# EAGLE design NSA_Control_FinalPTH3_compact (EAGLE 6.4)
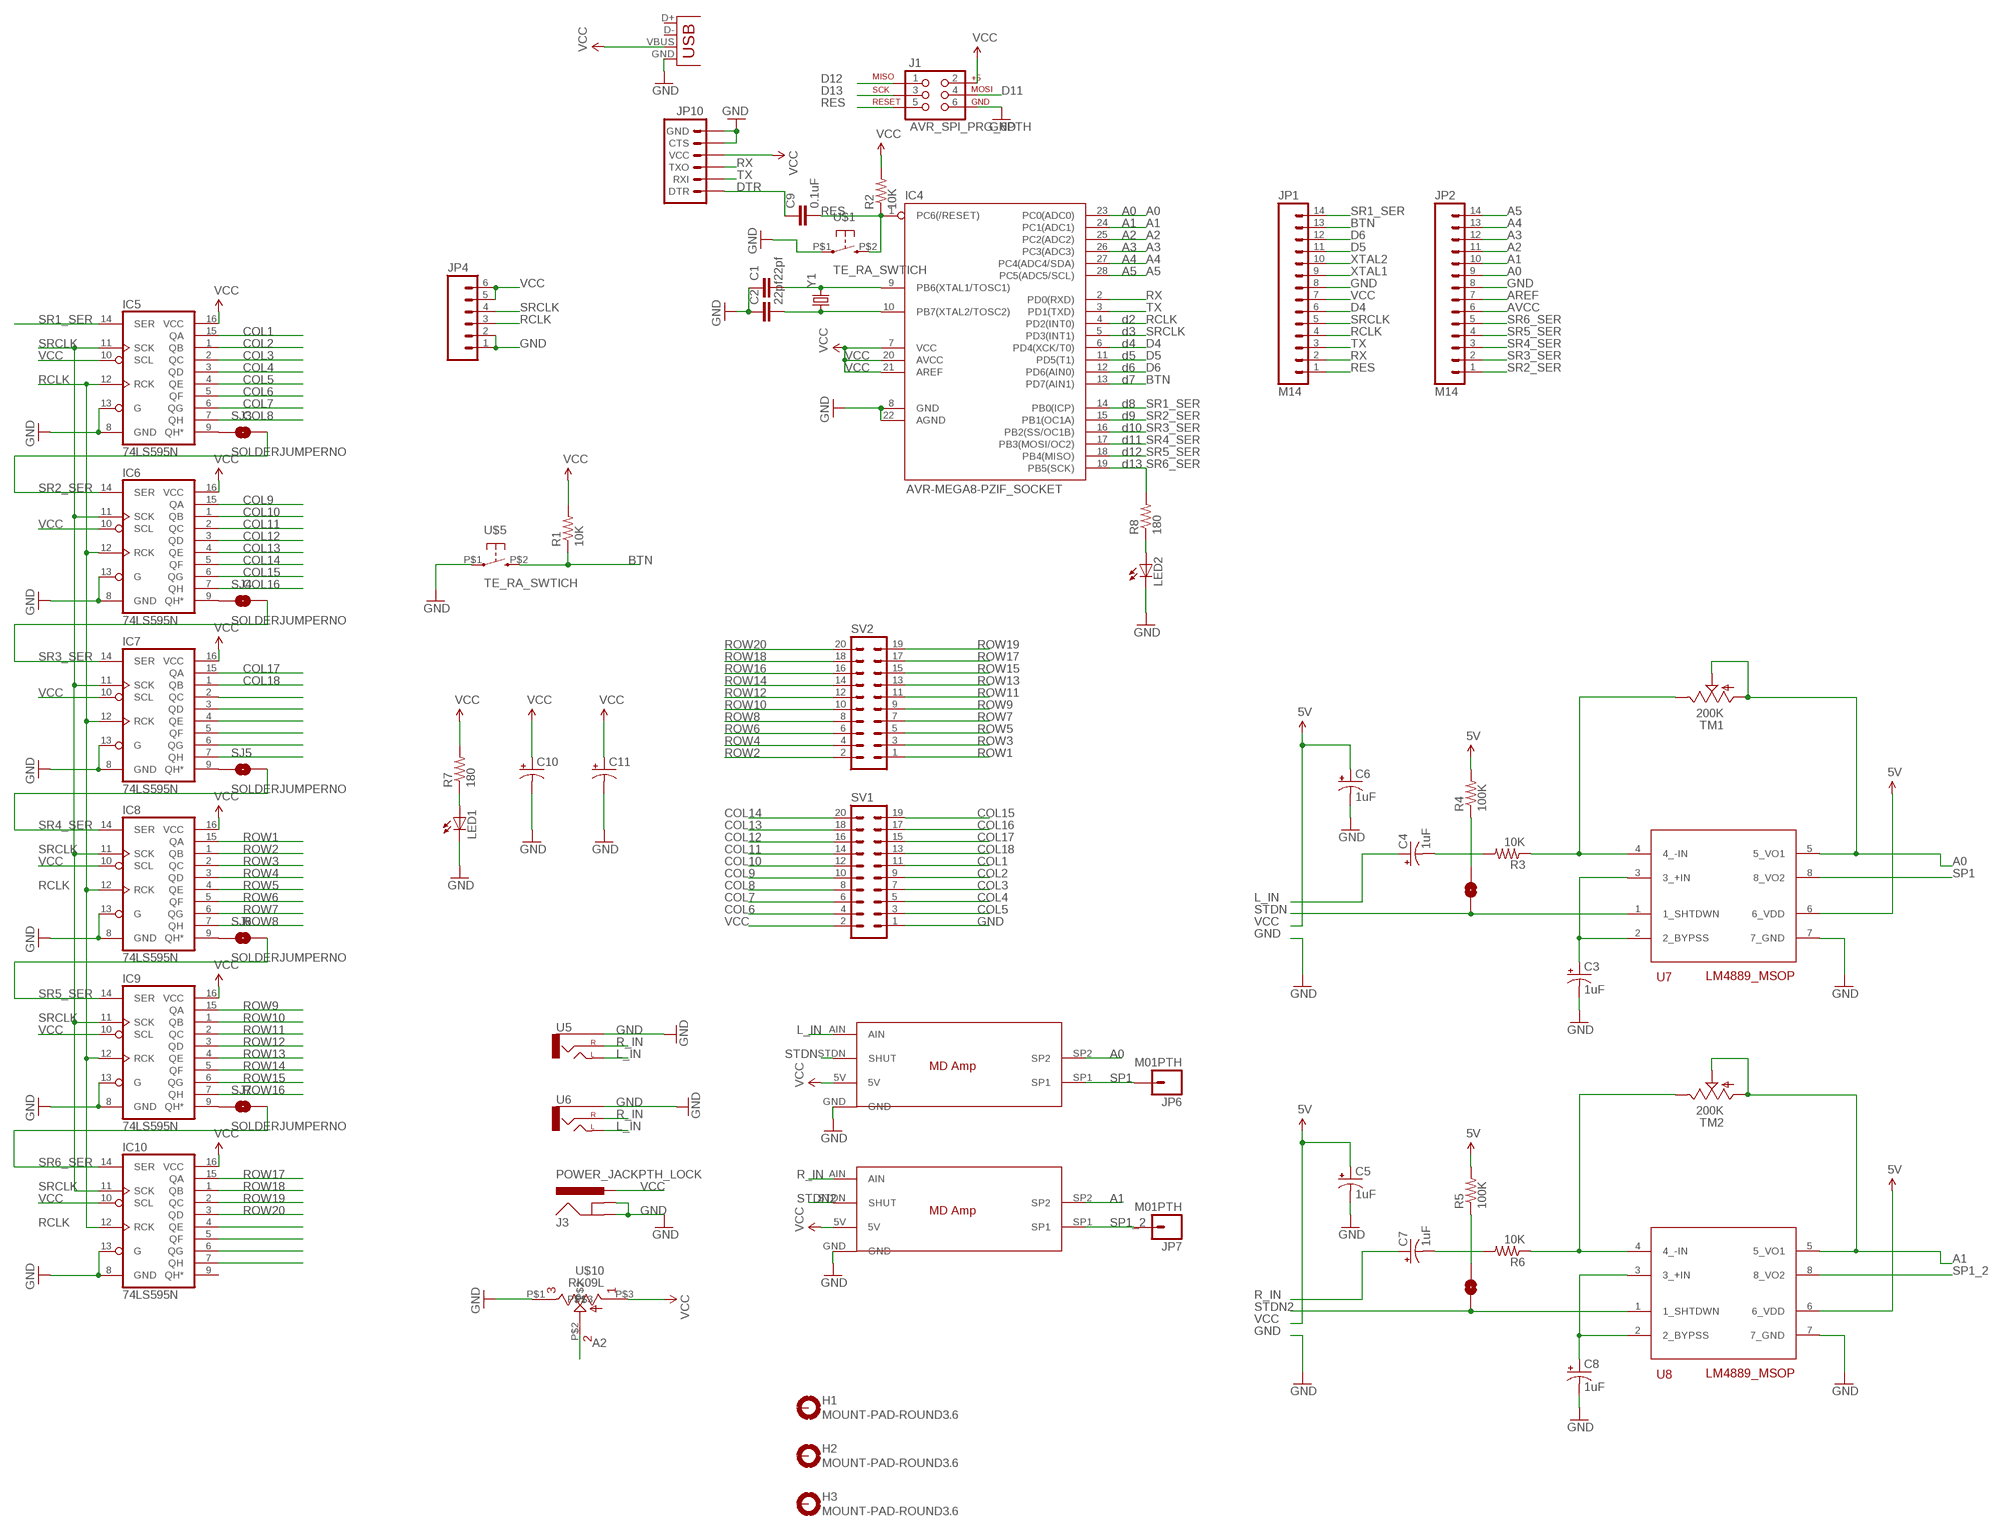
[diagram p0: schematic, sheet 1]

## Parts
C1  22pf  CAPPTH  [CAP-PTH-SMALL]
C2  22pf  CAPPTH  [CAP-PTH-SMALL]
C3  1uF  CAP_POL1206-KIT  [EIA3216-KIT]
C4  1uF  CAP_POL1206-KIT  [EIA3216-KIT]
C5  1uF  CAP_POL1206-KIT  [EIA3216-KIT]
C6  1uF  CAP_POL1206-KIT  [EIA3216-KIT]
C7  1uF  CAP_POL1206-KIT  [EIA3216-KIT]
C8  1uF  CAP_POL1206-KIT  [EIA3216-KIT]
C9  0.1uF  CAPPTH  [CAP-PTH-SMALL]
C10  CPOL-USE5-8.5  [E5-8,5]
C11  CPOL-USE5-8.5  [E5-8,5]
H1  MOUNT-PAD-ROUND3.6  [3,6-PAD]
H2  MOUNT-PAD-ROUND3.6  [3,6-PAD]
H3  MOUNT-PAD-ROUND3.6  [3,6-PAD]
IC4  AVR-MEGA8-PZIF_SOCKET  [DIL28-3-ZIF_SOCKET]
IC5  74LS595N  [DIL16]
IC6  74LS595N  [DIL16]
IC7  74LS595N  [DIL16]
IC8  74LS595N  [DIL16]
IC9  74LS595N  [DIL16]
IC10  74LS595N  [DIL16]
J1  AVR_SPI_PRG_6PTH  [2X3]
J3  POWER_JACKPTH_LOCK  [POWER_JACK_PTH_LOCK]
JP1  M14  [1X14]
JP2  M14  [1X14]
JP4  M06LONGPADS  [1X06_LONGPADS]
JP6  M01PTH  [1X01]
JP7  M01PTH  [1X01]
JP10  ARDUINO_SERIAL_PROGRAMLOCK  [1X06_LOCK]
LED1  LED5MM  [LED5MM]
LED2  LED5MM  [LED5MM]
R1  10K  RESISTORPTH-1/4W  [AXIAL-0.4]
R2  10K  RESISTORPTH-1/4W  [AXIAL-0.4]
R3  10K  RESISTOR1206  [1206]
R4  100K  RESISTOR1206  [1206]
R5  100K  RESISTOR1206  [1206]
R6  10K  RESISTOR1206  [1206]
R7  180  RESISTORPTH-1/4W  [AXIAL-0.4]
R8  180  RESISTORPTH-1/4W  [AXIAL-0.4]
SJ1  SOLDERJUMPERNC  [SJ_2S]
SJ2  SOLDERJUMPERNC  [SJ_2S]
SJ3  SOLDERJUMPERNO  [SJ_2S-NO]
SJ4  SOLDERJUMPERNO  [SJ_2S-NO]
SJ5  SOLDERJUMPERNO  [SJ_2S-NO]
SJ6  SOLDERJUMPERNO  [SJ_2S-NO]
SJ7  SOLDERJUMPERNO  [SJ_2S-NO]
SV1  ML20  [ML20]
SV2  ML20  [ML20]
TM1  200K  TRIM  [6MM]
TM2  200K  TRIM  [6MM]
U5  AUDIO-JACKPTH  [AUDIO-JACK]
U6  AUDIO-JACKPTH  [AUDIO-JACK]
U7  LM4889_MSOP  [MSOP8]
U8  LM4889_MSOP  [MSOP8]
U$1  TE_RA_SWTICH  [TE_RA_SWITCH]
U$5  TE_RA_SWTICH  [TE_RA_SWITCH]
U$6  MD_AMP  [MD_AMP]
U$7  MD_AMP  [MD_AMP]
U$10  RK09L  [RK09L]
X1  USBSMD  [USB-MINIB]
Y1  CRYSTALHC49UV  [HC49U-V]

## Nets
6V: R4.2 R5.2 U7.6(6_VDD) U8.6(6_VDD) ; supply symbol labelled 5V
A0: IC4.23(PC0(ADC0)) JP2.9 TM1.A TM1.S U7.5(5_VO1) U$6.SP2
A1: IC4.24(PC1(ADC1)) JP2.10 TM2.A TM2.S U8.5(5_VO1) U$7.SP2
A2: IC4.25(PC2(ADC2)) JP2.11 U$10.P$2
A3: IC4.26(PC3(ADC3)) JP2.12
A4: IC4.27(PC4(ADC4/SDA)) JP2.13
A5: IC4.28(PC5(ADC5/SCL)) JP2.14
AREF: JP2.7
AVCC: JP2.6
BTN: IC4.13(PD7(AIN1)) JP1.13 R1.P$1 U$5.P$2
COL1: IC5.15(QA) SV1.11
COL2: IC5.1(QB) SV1.9
COL3: IC5.2(QC) SV1.7
COL4: IC5.3(QD) SV1.5
COL5: IC5.4(QE) SV1.3
COL6: IC5.5(QF) SV1.4
COL7: IC5.6(QG) SV1.6
COL8: IC5.7(QH) SV1.8
COL9: IC6.15(QA) SV1.10
COL10: IC6.1(QB) SV1.12
COL11: IC6.2(QC) SV1.14
COL12: IC6.3(QD) SV1.16
COL13: IC6.4(QE) SV1.18
COL14: IC6.5(QF) SV1.20
COL15: IC6.6(QG) SV1.19
COL16: IC6.7(QH) SV1.17
COL17: IC7.15(QA) SV1.15
COL18: IC7.1(QB) SV1.13
D4: IC4.6(PD4(XCK/T0)) JP1.6
D5: IC4.11(PD5(T1)) JP1.11
D6: IC4.12(PD6(AIN0)) JP1.12
D11: J1.4
D12: J1.1
D13: J1.3
DTR: C9.1 JP10.1(DTR)
GND: C1.1 C2.1 C3.C(-) C5.C(-) C6.C(-) C8.C(-) C10.- C11.- IC4.8(GND) IC4.22(AGND) IC5.8(GND) IC5.13(G) IC6.8(GND) IC6.13(G) IC7.8(GND) IC7.13(G) IC8.8(GND) IC8.13(G) IC9.8(GND) IC9.13(G) IC10.8(GND) IC10.13(G) J1.6 J3.GND J3.GNDBREAK JP1.8 JP2.8 JP4.1 JP4.2 JP10.5(CTS) JP10.6(GND) LED1.K(C) LED2.K(C) SV1.1 U5.SLEEVE U6.SLEEVE U7.7(7_GND) U8.7(7_GND) U$1.P$1 U$5.P$1 U$6.GND U$7.GND U$10.P$1 X1.GND
L_IN: C4.A(+) U5.TIP(LEFT) U6.TIP(LEFT) U$6.AIN
N$1: IC7.4(QE)
N$2: IC7.5(QF)
N$3: IC7.6(QG)
N$4: IC7.7(QH)
N$5: IC10.4(QE)
N$6: IC10.5(QF)
N$7: LED1.A R7.P$1
N$8: LED2.A R8.P$1
N$9: IC10.6(QG)
N$10: C8.A(+) U8.2(2_BYPSS) U8.3(3_+IN)
N$11: IC5.9(QH*) SJ3.1
N$12: IC6.9(QH*) SJ4.1
N$13: IC10.7(QH)
N$14: C3.A(+) U7.2(2_BYPSS) U7.3(3_+IN)
N$15: R6.1 TM2.E U8.4(4_-IN)
N$16: R3.1 TM1.E U7.4(4_-IN)
N$17: C4.C(-) R3.2
N$18: C7.C(-) R6.2
N$19: R4.1 SJ1.2
N$20: R5.1 SJ2.2
N$21: IC7.2(QC)
N$22: IC7.3(QD)
N$23: IC7.9(QH*) SJ5.1
N$24: IC8.9(QH*) SJ6.1
N$25: IC9.9(QH*) SJ7.1
R_IN: C7.A(+) U5.RING(RIGHT) U6.RING(RIGHT) U$7.AIN
RCLK: IC4.4(PD2(INT0)) IC5.12(RCK) IC6.12(RCK) IC7.12(RCK) IC8.12(RCK) IC9.12(RCK) IC10.12(RCK) JP1.4 JP4.3
RES: C9.2 IC4.1(PC6(/RESET)) J1.5 JP1.1 R2.P$1 U$1.P$2
ROW1: IC8.15(QA) SV2.1
ROW2: IC8.1(QB) SV2.2
ROW3: IC8.2(QC) SV2.3
ROW4: IC8.3(QD) SV2.4
ROW5: IC8.4(QE) SV2.5
ROW6: IC8.5(QF) SV2.6
ROW7: IC8.6(QG) SV2.7
ROW8: IC8.7(QH) SV2.8
ROW9: IC9.15(QA) SV2.9
ROW10: IC9.1(QB) SV2.10
ROW11: IC9.2(QC) SV2.11
ROW12: IC9.3(QD) SV2.12
ROW13: IC9.4(QE) SV2.13
ROW14: IC9.5(QF) SV2.14
ROW15: IC9.6(QG) SV2.15
ROW16: IC9.7(QH) SV2.16
ROW17: IC10.15(QA) SV2.17
ROW18: IC10.1(QB) SV2.18
ROW19: IC10.2(QC) SV2.19
ROW20: IC10.3(QD) SV2.20
RX: IC4.2(PD0(RXD)) JP1.2 JP10.3(TXO)
SP1: JP6.1 U7.8(8_VO2) U$6.SP1
SP1_2: JP7.1 U8.8(8_VO2) U$7.SP1
SR1_SER: IC4.14(PB0(ICP)) IC5.14(SER) JP1.14
SR2_SER: IC4.15(PB1(OC1A)) IC6.14(SER) JP2.1 SJ3.2
SR3_SER: IC4.16(PB2(SS/OC1B)) IC7.14(SER) JP2.2 SJ4.2
SR4_SER: IC4.17(PB3(MOSI/OC2)) IC8.14(SER) JP2.3 SJ5.2
SR5_SER: IC4.18(PB4(MISO)) IC9.14(SER) JP2.4 SJ6.2
SR6_SER: IC4.19(PB5(SCK)) IC10.14(SER) JP2.5 R8.P$2 SJ7.2
SRCLK: IC4.5(PD3(INT1)) IC5.11(SCK) IC6.11(SCK) IC7.11(SCK) IC8.11(SCK) IC9.11(SCK) IC10.11(SCK) JP1.5 JP4.4
STDN: SJ1.1 U7.1(1_SHTDWN) U$6.STDN(SHUT)
STDN2: SJ2.1 U8.1(1_SHTDWN) U$7.STDN(SHUT)
TX: IC4.3(PD1(TXD)) JP1.3 JP10.2(RXI)
VCC: C5.A(+) C6.A(+) C10.+ C11.+ IC4.7(VCC) IC4.20(AVCC) IC4.21(AREF) IC5.10(SCL) IC5.16(VCC) IC6.10(SCL) IC6.16(VCC) IC7.10(SCL) IC7.16(VCC) IC8.10(SCL) IC8.16(VCC) IC9.10(SCL) IC9.16(VCC) IC10.10(SCL) IC10.16(VCC) J1.2 J3.PWR JP1.7 JP4.5 JP4.6 JP10.4(VCC) R1.P$2 R2.P$2 R7.P$2 SV1.2 U$6.5V U$7.5V U$10.P$3 X1.VBUS ; supply symbol labelled 5V
XTAL1: C1.2 IC4.9(PB6(XTAL1/TOSC1)) JP1.9 Y1.2
XTAL2: C2.2 IC4.10(PB7(XTAL2/TOSC2)) JP1.10 Y1.1
Unconnected: H1.B3,6(MOUNT) H2.B3,6(MOUNT) H3.B3,6(MOUNT) IC10.9(QH*) X1.D+ X1.D-

## Notes on the sheet
- A0
- A1
- A2
- A3
- A4
- A5
- d2
- d3
- d4
- d5
- d6
- d7
- d8
- d9
- d10
- d11
- d12
- d13

## Library data of the parts
C1 C2 C9 = sparkFun:CAP: Capacitor Standard 0603 ceramic capacitor, and 0.1" leaded capacitor.
C3-C8 = sparkFun:CAP_POL: Capacitor Polarized These are standard SMD and PTH capacitors. Normally 10uF, 47uF, and 100uF in electrolytic and tantalum varieties. Always verify the external diameter of the through hole cap, it varies with capacity, voltage, and manufacturer. The EIA devices should be standard.
C10 C11 = adafruit:CPOL-US: POLARIZED CAPACITOR, American symbol
H1-H3 = holes:MOUNT-PAD-ROUND: MOUNTING PAD, round
IC4 = sparkFun:AVR-MEGA8-P: MICROCONTROLLER 8 Kbytes FLASH 1 kbytes SRAM 512 bytes EEPROM USART 4-channel 10 bit ADC 2-channel 8 bit ADC
IC5-IC10 = sparkFun:74*595: 8-bit SHIFT REGISTER, output latch
J1 = sparkFun:AVR_SPI_PRG_6: AVR ISP 6 Pin This is the reduced ISP connector for AVR programming. Common on Arduino. This footprint will take up less PCB space and can be used with a 10-pin to 6-pin adapter such as SKU: BOB-08508
J3 = sparkFun:POWER_JACK: Power Jack This is the standard 5.5mm barrel jack for power. The PTH is the most common, proven, reliable, footprint. All others are experimental. The Slot footprint only works if the mill layer is transmitted to the PCB fab house so be warned. Spark Fun Electronics SKU : PRT-00119. Mating wall wart : TOL-00298 (and others)
JP1 JP2 = sparkFun:M14: Header 14 Standard 14-pin 0.1" header. Use with straight break away headers (SKU : PRT-00116), right angle break away headers (PRT-00553), swiss pins (PRT-00743), machine pins (PRT-00117), and female headers (PRT-00115).
JP4 = sparkFun:M06: Header 6 Standard 6-pin 0.1" header. Use with straight break away headers (SKU : PRT-00116), right angle break away headers (PRT-00553), swiss pins (PRT-00743), machine pins (PRT-00117), and female headers (PRT-00115). Molex polarized connector foot print use with SKU : PRT-08094 with associated crimp pins and housings. NOTES ON THE VARIANTS LOCK and LOCK_LONGPADS... This footprint was designed to help hold the alignment of a through-hole component (i.e. 6-pin header) while soldering it into place. You may notice that each hole has been shifted either up or down by 0.005 of an inch from it's more standard position (which is a perfectly straight line). This slight alteration caused the pins (the squares in the middle) to touch the edges of the holes. Because they are alternating, it causes a "brace" to hold the component in place. 0.005 has proven to be the perfect amount of "off-center" position when using our standard breakaway headers. Although looks a little odd when you look at the bare footprint, once you have a header in there, the alteration is very hard to notice. Also, if you push a header all the way into place, it is covered up entirely on the bottom side. This idea of altering the position of holes to aid alignment will be further integrated into the Sparkfun Library for other footprints. It can help hold any component with 3 or more connection pins.
JP6 JP7 = sparkFun:M01: Header 1 Standard 1-pin 0.1" header. Use with straight break away headers (SKU : PRT-00116), right angle break away headers (PRT-00553), swiss pins (PRT-00743), machine pins (PRT-00117), and female headers (PRT-00115).
JP10 = sparkFun:ARDUINO_SERIAL_PROGRAM
LED1 LED2 = sparkFun:LED: LEDs Standard schematic elements and footprints for 5mm, 3mm, 1206, and 0603 sized LEDs. 5mm - Spark Fun Electronics SKU : COM-00529 (and others)
R1-R8 = sparkFun:RESISTOR: Resistor Basic schematic elements and footprints for 0603, 1206, and PTH resistors.
SJ1 SJ2 = ModernDevice:SOLDERJUMPER: Solder Jumper Standard SMD solder jumper. Used to automate production. Two varients : Normally Open and Normally Closed are the same, but have different paste layers. NC will have a large amount of paste and should jumper during reflow.
SJ3-SJ7 = sparkFun:SOLDERJUMPER: Solder Jumper Standard SMD solder jumper. Used to automate production. Two varients : Normally Open and Normally Closed are the same, but have different paste layers. NC will have a large amount of paste and should jumper during reflow.
SV1 SV2 = con-harting-ml:ML20: HARTING; OC_FARNELL: unknown; OC_NEWARK: unknown
TM1 TM2 = adafruit:TRIM
U5 U6 = sparkFun:AUDIO-JACK: 3.5mm Audio Jack Simple 3.5mm common PCB mount audio jack. SKU: PRT-08032
U7 U8 = ModernDevice:LM4889: LM4889 1 W Audio Amp
U$1 U$5 = 001_BoltCustom:TE_RA_SWTICH
U$6 U$7 = 001_BoltCustom:MD_AMP
U$10 = 001_BoltCustom:RK09L
X1 = sparkFun:USB: USB Connectors USB-B-PTH is fully proven SKU : PRT-00139 USB-miniB is fully proven SKU : PRT-00587 USB-A-PCB is untested. USB-A-H is throughly reviewed, but untested. Spark Fun Electronics SKU : PRT-00437 USB-B-SMT is throughly reviewed, but untested. Needs silkscreen touching up. USB-A-S has not been used/tested USB-MB-H has not been used/tested
Y1 = sparkFun:CRYSTAL: Crystals Various standard crystals. Proven footprints. Spark Fun Electronics SKU : COM-00534

## Board
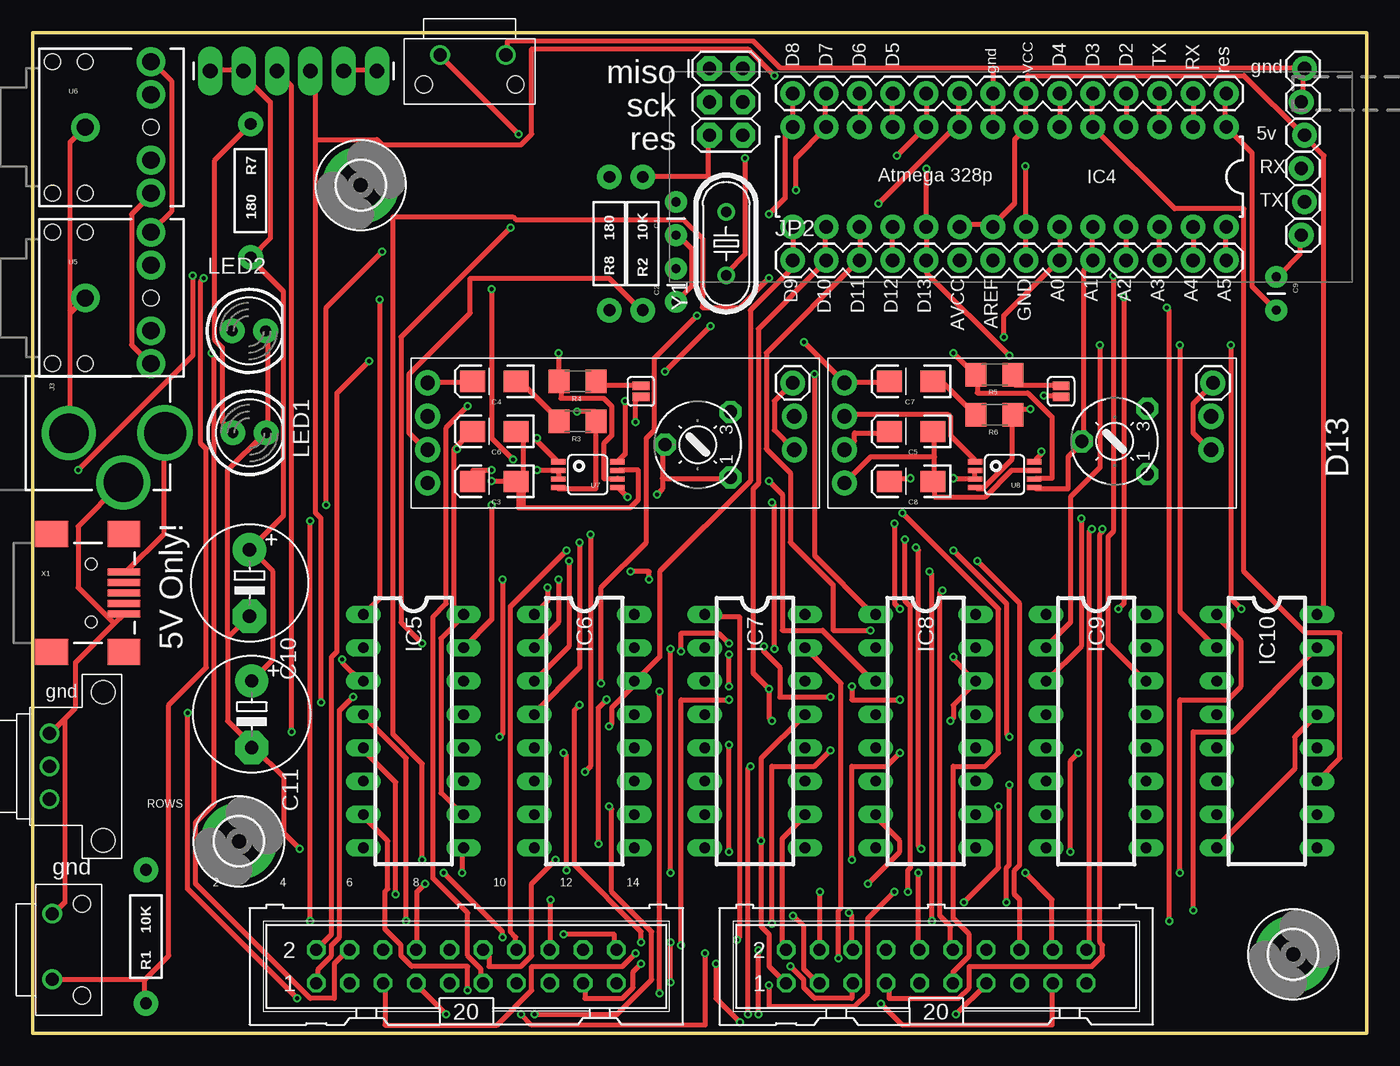
[diagram p1: board, top side]
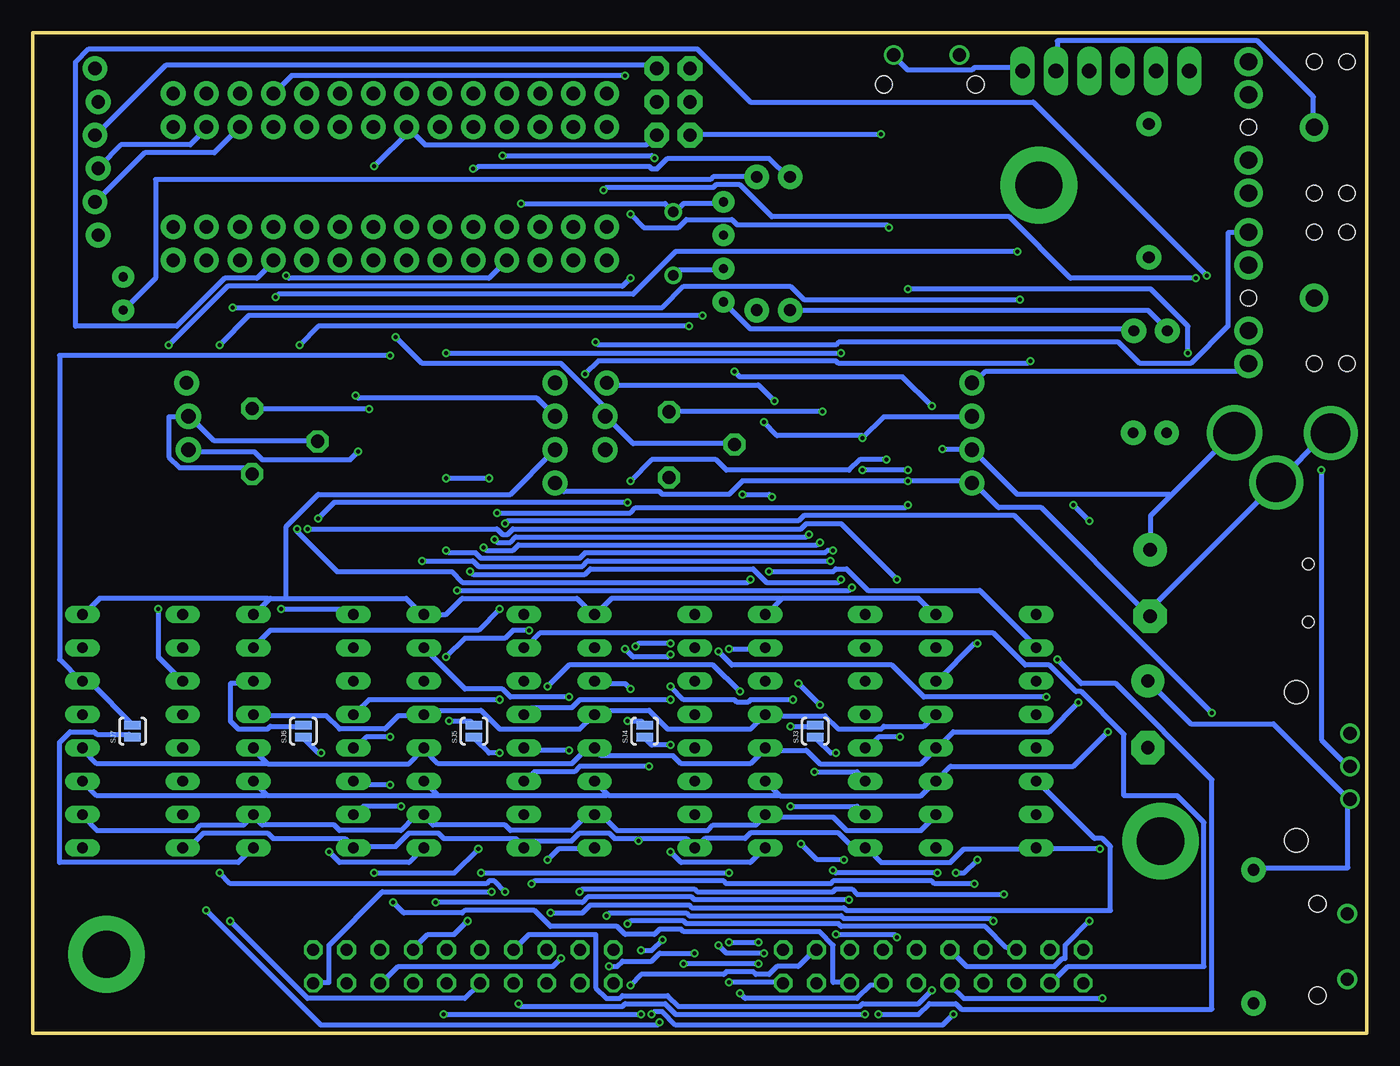
[diagram p2: board, bottom side, seen from below]

Size 101.6 x 76.2 mm. Coordinates in mm from the lower left corner, seen from the top.
Outline: 0,0 101.6,0 101.6,76.2 0,76.2 0,0
Copper layers (1*16): Top 0.035mm / dielectric 1.5mm / Bottom 0.035mm
Design rules "default *": minimum track width 15mil, minimum drill 12mil, track to track 7mil, track to pad 7mil, pad to pad 7mil, via to via 7mil, smd to smd 0mil, copper to edge 10mil, drill to drill 10mil, minimum pad ring 10mil, minimum via ring 6mil, stop-mask expansion 2mil, vias tented up to drill 100mil, thermal gap 10mil

### Footprints (pad centres in the part's own frame; a part is rotated, then mirrored left to right if it is on the bottom)
CAP-PTH-SMALL = drill 0.7 pad 1.651: 1 0,0; 2 2.54,0
EIA3216-KIT = smd 1.9 x 1.6: A 1.65,0; C -1.65,0
E5-8,5 = drill 1.016 pad 2.54: + -2.54,0 | drill 1.016 pad 2.54 octagon: - 2.54,0
3,6-PAD = drill 3.6 pad 5.842: B3,6 0,0
DIL28-3-ZIF_SOCKET = drill 1.016 pad 1.88: 1 -16.51,-3.81; 2 -13.97,-3.81; 3 -11.43,-3.81; 4 -8.89,-3.81; 5 -6.35,-3.81; 6 -3.81,-3.81; 7 -1.27,-3.81; 8 1.27,-3.81; 9 3.81,-3.81; 10 6.35,-3.81; 11 8.89,-3.81; 12 11.43,-3.81; 13 13.97,-3.81; 14 16.51,-3.81; 15 16.51,3.81; 16 13.97,3.81; 17 11.43,3.81; 18 8.89,3.81; 19 6.35,3.81; 20 3.81,3.81; 21 1.27,3.81; 22 -1.27,3.81; 23 -3.81,3.81; 24 -6.35,3.81; 25 -8.89,3.81; 26 -11.43,3.81; 27 -13.97,3.81; 28 -16.51,3.81
DIL16 = drill 0.813 long: 1 -8.89,-3.81; 2 -6.35,-3.81; 3 -3.81,-3.81; 4 -1.27,-3.81; 5 1.27,-3.81; 6 3.81,-3.81; 7 6.35,-3.81; 8 8.89,-3.81; 9 8.89,3.81; 10 6.35,3.81; 11 3.81,3.81; 12 1.27,3.81; 13 -1.27,3.81; 14 -3.81,3.81; 15 -6.35,3.81; 16 -8.89,3.81
2X3 = drill 1.016 pad 1.88 octagon: 1 0,0; 2 0,2.54; 3 2.54,0; 4 2.54,2.54; 5 5.08,0; 6 5.08,2.54
POWER_JACK_PTH_LOCK = drill 2.997 pad 4.115: GND 0.025,6.557; GNDBREAK 3.762,10.7 | drill 3.2 pad 4.115: PWR 0,13.878
1X14 = drill 1.016 pad 1.88: 1 0,0; 2 2.54,0; 3 5.08,0; 4 7.62,0; 5 10.16,0; 6 12.7,0; 7 15.24,0; 8 17.78,0; 9 20.32,0; 10 22.86,0; 11 25.4,0; 12 27.94,0; 13 30.48,0; 14 33.02,0
1X06_LONGPADS = drill 1.118 pad 1.88 long: 1 0,0; 2 2.54,0; 3 5.08,0; 4 7.62,0; 5 10.16,0; 6 12.7,0
1X01 = drill 1.016 pad 1.88: 1 0,0
1X06_LOCK = drill 1.016 pad 1.88: 1 0,0; 2 2.54,-0.254; 3 5.08,0; 4 7.62,-0.254; 5 10.16,0; 6 12.7,-0.254
LED5MM = drill 0.813 pad 1.88: A -1.27,0; K 1.27,0
AXIAL-0.4 = drill 0.9 pad 1.88: P$1 -5.08,0; P$2 5.08,0
1206 = smd 1.6 x 1.8: 1 -1.4,0; 2 1.4,0
SJ_2S = smd 0.635 x 1.27: 1 -0.412,0; 2 0.412,0
SJ_2S-NO = smd 0.635 x 1.27: 1 -0.45,0; 2 0.45,0
ML20 = drill 0.914 octagon: 1 -11.43,-1.27; 2 -11.43,1.27; 3 -8.89,-1.27; 4 -8.89,1.27; 5 -6.35,-1.27; 6 -6.35,1.27; 7 -3.81,-1.27; 8 -3.81,1.27; 9 -1.27,-1.27; 10 -1.27,1.27; 11 1.27,-1.27; 12 1.27,1.27; 13 3.81,-1.27; 14 3.81,1.27; 15 6.35,-1.27; 16 6.35,1.27; 17 8.89,-1.27; 18 8.89,1.27; 19 11.43,-1.27; 20 11.43,1.27
6MM = drill 1 pad 1.676 octagon: A -2.5,-2.5; E 2.5,-2.5; S 0,2.5
AUDIO-JACK = drill 1.3 pad 2.184: RING 5,5; RSH 5,2.5; SLEEVE 0,0; TIP 5,-5; TSH 5,-2.5 | hole 1.2: 0,5; -2.5,5; -2.5,-5; 0,-5; 5,0
MSOP8 = smd 0.4 x 1.1: 1 -0.975,-2.25; 2 -0.325,-2.25; 3 0.325,-2.25; 4 0.975,-2.25; 5 0.975,2.25; 6 0.325,2.25; 7 -0.325,2.25; 8 -0.975,2.25
TE_RA_SWITCH = drill 1: P$1 -2.75,2.75; P$2 2.25,2.75 | hole 1.3: -3.5,5; 3.5,5
MD_AMP = drill 1.1 pad 1.93: 5V 1.27,4.445; AIN 1.27,9.525; GND 1.27,1.905; SP1 29.21,4.445; SP2 29.21,6.985; STDN 1.27,6.985
RK09L = drill 1: P$1 -2.5,0; P$2 0,0; P$3 2.5,0 | hole 1.8: -5.65,4.1; 5.65,4.1
USB-MINIB = smd 2.5 x 0.5: D+ 2.5,0; D- 2.5,0.8; GND 2.5,-1.6; ID 2.5,-0.8; VBUS 2.5,1.6 | smd 2.5 x 2: MTN1 -3,4.5; MTN2 2.5,4.5; MTN3 -3,-4.5; MTN4 2.5,-4.5 | hole 0.9: 0,2.2; 0,-2.2
HC49U-V = drill 0.813: 1 -2.413,0; 2 2.413,0

### Placement (x,y rotation side)
C1  49,60.78 90 top
C2  49,55.7 90 top
C3  35.15,42.03 180 top
C4  35.15,49.65 180 top
C5  66.9,45.84 180 top
C6  35.15,45.84 180 top
C7  66.9,49.65 180 top
C8  66.9,42.03 180 top
C9  94.72,57.61 270 top
C10  16.51,34.29 270 top
C11  16.67,24.29 270 top
H1  15.7,14.62 0 top
H2  96,6 0 top
H3  24.98,64.59 0 top
IC4  74.4,65.23 180 top
IC5  29,23 270 top
IC6  42,23 270 top
IC7  55,23 270 top
IC8  68,23 270 top
IC9  81,23 270 top
IC10  94,23 270 top
J1  51.54,73.48 270 top
J3  -3.81,45.72 270 top
JP1  90.91,71.58 180 top
JP2  57.89,58.88 0 top
JP4  26.21,73.3 180 top
JP6  57.88,49.52 270 top
JP7  89.89,49.52 270 top
JP10  96.62,60.78 90 top
LED1  16.51,45.72 0 top
LED2  16.46,53.49 0 top
R1  8.62,7.35 90 top
R2  46.46,60.15 270 top
R3  41.5,46.6 180 top
R4  41.5,49.65 180 top
R5  73.25,50.16 180 top
R6  73.25,47.11 180 top
R7  16.59,64.18 270 top
R8  43.92,60.15 90 top
SJ1  46.33,48.89 90 top
SJ2  78.33,48.89 90 top
SJ3  42,23 90 bottom
SJ4  55,23 90 bottom
SJ5  68,23 90 bottom
SJ6  81,23 90 bottom
SJ7  94,23 90 bottom
SV1  68.81,5.08 0 top
SV2  33.02,5.08 0 top
TM1  50.64,44.83 90 top
TM2  82.39,45.08 90 top
U5  4,56 0 top
U6  4,69 0 top
U7  42.26,42.54 270 top
U8  74.01,42.54 270 top
U$1  33.27,77.27 180 top
U$5  -1.27,6.35 270 top
U$6  28.8,40 0 top
U$7  60.55,40 0 top
U$10  1.27,20.32 270 top
X1  4.45,33.53 0 top
Y1  52.81,60.15 90 top

### Tracks (layer width: path | path; a pad name or v marks a point on that pad's centre or on a via)
6V  (via drill 0.3)
  Top 0.381: U7.6 44.5,42.27 43.48,42.27 43.48,44.91 44.09,45.52 44.09,47.75 43.48,48.36 40.23,48.36 40.23,49.58 R4.2 40.03,49.78 v40.03,51.82 | U8.6 76.4,42.27 77.62,42.27 77.62,46.94 75.79,48.77 71.93,48.77 71.93,49.99 R5.2 71.73,50.19 v70.1,51.82
  Bottom 0.381: v70.1,51.82 v40.03,51.82
A0  (via drill 0.3)
  Top 0.381: IC4.23 78.23,61.37 78.23,58.93 JP2.9 78.03,58.73 73.97,54.66 v73.97,53.03 | v45.31,40.84 44.7,41.45 U7.5 | v47.55,41.05 47.95,41.45 47.95,42.27 | 47.95,42.27 47.95,44.7 TM1.S | 47.95,42.27 53.03,42.27 TM1.A
  Bottom 0.381: v45.31,40.84 45.52,41.05 v47.55,41.05 | TM1.S 48.16,44.91 55.88,44.91 57.91,46.94 U$6.SP2 58.12,47.14 58.12,47.75 61.37,51 71.93,51 v73.97,53.03
A1
  Top 0.381: IC4.24 80.67,61.37 80.67,58.93 JP2.10 80.67,58.73 80.06,58.12 80.06,45.11 TM2.S 79.86,44.91 78.84,43.89 78.84,41.45 76.4,41.45 U8.5
  Bottom 0.381: TM2.A 84.94,42.67 85.34,43.08 90.42,43.08 91.24,43.89 91.24,46.94 89.81,46.94 U$7.SP2 89.61,46.94 87.78,45.11 80.06,45.11 TM2.S
A2  (via drill 0.3)
  Top 0.381: v3.45,42.88 12.19,51.61 v12.19,57.71 | IC4.25 83.31,61.37 83.31,58.93 JP2.11
  Bottom 0.381: v3.45,42.88 3.45,22.35 1.42,20.32 U$10.P$2 | v12.19,57.71 25.4,70.92 46.94,70.92 51,74.98 97.33,74.98 98.35,73.97 98.35,53.85 90.63,53.85 86.97,57.51 84.53,57.51 83.31,58.73 JP2.11
A3
  Top 0.381: JP2.12 85.75,58.93 85.75,61.37 IC4.26
A4
  Top 0.381: JP2.13 88.39,58.93 88.39,61.37 IC4.27
A5
  Top 0.381: JP2.14 90.83,58.93 90.83,61.37 IC4.28
BTN  (via drill 0.3)
  Top 0.381: JP1.13 60.35,71.53 60.35,69.09 IC4.13 60.35,68.89 58.12,66.65 v58.12,64.21 | 8.53,4.06 1.63,4.06 U$5.P$2 | 8.53,4.06 8.53,2.44 R1.P$1 | v13.01,57.51 12.8,57.3 12.8,44.91 13.21,44.5 13.21,27.84 10.36,24.99 10.36,5.89 8.53,4.06
  Bottom 0.381: v58.12,64.21 57.91,64.41 49.78,64.41 49.58,64.62 47.75,64.62 45.31,62.18 27.23,62.18 22.55,57.51 v13.01,57.51
COL1  (via drill 0.3)
  Top 0.381: v34.95,40.23 34.95,31.5 32.92,29.46 IC5.15 | v66.24,39.62 73.56,32.31 73.56,21.34 72.54,20.32 70.1,20.32 70.1,8.74 71.32,7.52 71.32,5.89 70.1,4.67 70.1,3.86 SV1.11
  Bottom 0.381: v34.95,40.23 35.15,40.03 55.68,40.03 56.08,39.62 v66.24,39.62
COL2  (via drill 0.3)
  Top 0.381: v26.42,55.88 26.42,33.12 25.2,31.9 IC5.1 | v86.36,55.27 86.56,55.07 v86.56,8.53
  Bottom 0.381: v26.42,55.88 42.88,55.88 43.89,56.9 52.02,56.9 53.65,55.27 v86.36,55.27 | v86.56,8.53 80.67,2.64 68.68,2.64 67.67,3.66 SV1.9
COL3  (via drill 0.3)
  Top 0.381: v45.52,35.15 46.94,35.15 v46.94,34.54 | v81.48,38.41 81.48,38.2 81.28,38 81.28,6.91 81.48,6.71 81.48,5.89 80.67,5.08 71.32,5.08 71.32,3.45 70.51,2.64 65.23,2.64 65.23,3.45 65.02,3.66 SV1.7
  Bottom 0.381: v45.52,35.15 40.64,35.15 40.44,35.36 39.62,35.36 38,33.73 29.46,33.73 25.2,29.46 IC5.2 | v46.94,34.54 47.14,34.34 68.89,34.34 69.7,35.15 78.44,35.15 81.48,38.2 v81.48,38.41
COL4  (via drill 0.3)
  Top 0.381: v23.57,28.45 23.57,28.25 24.99,26.82 IC5.3 | v37.19,1.42 38,0.61 51.21,0.61 v51.21,6.1 | v57.71,5.08 58.73,4.06 58.73,3.45 59.54,2.64 62.38,2.64 62.38,3.66 SV1.5
  Bottom 0.381: v23.57,28.45 21.74,26.62 19.1,26.62 11.79,19.3 11.79,1.83 30.89,1.83 31.29,2.23 33.33,2.23 34.14,1.42 v37.19,1.42 | v51.21,6.1 53.85,6.1 54.46,5.49 56.69,5.49 57.1,5.08 v57.71,5.08
COL5  (via drill 0.3)
  Top 0.381: v28.45,8.53 28.45,20.93 25.2,24.18 IC5.4 | v57.91,8.94 58.73,8.13 58.73,4.88 59.74,3.86 SV1.3
  Bottom 0.381: v28.45,8.53 28.65,8.74 39.83,8.74 40.03,8.94 51.61,8.94 51.82,9.14 57.71,9.14 v57.91,8.94
COL6  (via drill 0.3)
  Top 0.381: v27.64,10.57 27.64,19.1 25.2,21.54 IC5.5 | v59.94,10.77 59.94,6.5 SV1.4
  Bottom 0.381: v27.64,10.57 38.81,10.57 39.22,10.97 40.44,10.97 40.64,10.77 51,10.77 51.21,10.97 59.74,10.97 v59.94,10.77
COL7  (via drill 0.3)
  Top 0.381: v62.18,9.14 62.38,8.94 62.38,6.5 SV1.6
  Bottom 0.381: v62.18,9.14 59.74,9.14 59.13,9.75 51.61,9.75 51.41,9.55 39.83,9.55 39.62,9.35 19.51,9.35 19.51,14.22 20.12,14.83 20.73,14.83 24.99,19.1 IC5.6
COL8  (via drill 0.3)
  Top 0.381: v33.12,3.25 33.12,5.08 28.85,5.08 28.04,5.89 28.04,6.71 26.82,7.92 26.82,10.77 27.03,10.97 27.03,14.63 25.2,16.46 IC5.7
  Bottom 0.381: v33.12,3.25 34.14,2.23 38.41,2.23 38.61,2.03 52.43,2.03 53.24,2.85 56.69,2.85 56.9,2.64 57.91,2.64 58.73,3.45 58.73,7.52 63.8,7.52 64.82,6.5 SV1.8
COL9  (via drill 0.3)
  Top 0.381: v48.56,12.19 v48.56,29.26 | v67.46,12.19 67.46,6.5 SV1.10
  Bottom 0.381: v48.56,29.26 45.92,29.26 IC6.15 | v67.46,12.19 v48.56,12.19
COL10  (via drill 0.3)
  Top 0.381: v39.22,33.93 39.22,32.92 38.2,31.9 IC6.1 | v69.29,33.73 69.09,33.53 69.09,8.94 69.9,8.13 69.9,6.5 SV1.12
  Bottom 0.381: v39.22,33.93 39.42,33.73 v69.29,33.73
COL11  (via drill 0.3)
  Top 0.381: v40.03,34.54 40.03,31.29 38.2,29.46 IC6.2 | v68.28,35.15 68.48,34.95 v68.48,8.53
  Bottom 0.381: v40.03,34.54 40.23,34.34 45.72,34.34 46.74,35.36 59.13,35.36 59.54,34.95 68.07,34.95 v68.28,35.15 | v68.48,8.53 69.49,7.52 71.53,7.52 72.54,6.5 SV1.14
COL12  (via drill 0.3)
  Top 0.381: v40.84,35.97 40.84,29.46 38.2,26.82 IC6.3 | v71.93,35.97 75.18,32.72 75.18,12.8 74.78,12.39 74.78,10.57 75.18,10.16 75.18,6.5 SV1.16
  Bottom 0.381: v40.84,35.97 59.33,35.97 59.74,35.56 67.67,35.56 68.07,35.97 v71.93,35.97
COL13  (via drill 0.3)
  Top 0.381: v41.66,37.39 41.66,27.84 38.2,24.38 IC6.4 | v67.26,36.98 67.46,36.78 67.46,14.22 v67.67,14.02 | v75.59,12.19 77.62,10.16 77.62,6.5 SV1.18
  Bottom 0.381: v41.66,37.39 41.86,37.19 64.62,37.19 65.02,36.78 67.06,36.78 v67.26,36.98 | v67.67,14.02 69.49,12.19 v75.59,12.19
COL14  (via drill 0.3)
  Top 0.381: v35.56,22.55 35.76,22.76 v35.76,34.54 | v80.67,38.41 80.47,38.2 80.47,6.71 80.26,6.5 SV1.20
  Bottom 0.381: v35.56,22.55 37.19,22.55 38,21.74 IC6.5 | v35.76,34.54 40.03,38.81 42.67,38.81 43.08,38.41 65.02,38.41 65.43,38 65.84,38 66.24,38.41 v80.67,38.41
COL15  (via drill 0.3)
  Top 0.381: v42.06,19.91 42.47,20.32 v42.47,38 | v66.45,37.59 66.45,32.92 66.85,32.51 66.85,12.6 66.65,12.39 v66.65,10.77
  Bottom 0.381: v42.06,19.91 38.81,19.91 38.2,19.3 IC6.6 | v42.47,38 42.67,37.8 64.82,37.8 65.23,37.39 66.24,37.39 v66.45,37.59 | v66.65,10.77 74.98,10.77 79.05,6.71 79.05,3.86 80.06,3.86 SV1.19
COL16  (via drill 0.3)
  Top 0.381: v43.89,17.27 44.09,17.07 44.09,10.77 47.14,7.72 47.14,4.06 44.5,1.42 v38.2,1.42 | v64.62,2.23 66.24,0.61 77.62,0.61 77.62,3.66 SV1.17
  Bottom 0.381: v43.89,17.27 38.81,17.27 38.2,16.66 IC6.7 | v38.2,1.42 52.63,1.42 53.44,2.23 56.49,2.23 56.69,2.03 64.41,2.03 v64.62,2.23
COL17  (via drill 0.3)
  Top 0.381: v61.37,5.69 61.37,9.35 61.57,9.55 61.57,26.62 58.93,29.26 IC7.15
  Bottom 0.381: v61.37,5.69 61.98,5.08 73.76,5.08 74.98,3.86 SV1.15
COL18  (via drill 0.3)
  Top 0.381: v53.65,7.11 53.85,7.32 53.85,31.7 51.21,31.7 IC7.1 | v55.27,1.42 v55.27,6.3 | v70.31,1.42 72.54,3.66 SV1.13
  Bottom 0.381: v53.65,7.11 54.46,6.3 v55.27,6.3 | v70.31,1.42 v55.27,1.42
D4
  Top 0.381: IC4.6 78.23,69.09 78.23,71.53 JP1.6
D5
  Top 0.381: IC4.11 65.43,69.09 65.43,71.53 JP1.11
D6
  Top 0.381: IC4.12 62.99,69.09 62.99,71.53 JP1.12
DTR
  Top 0.381: C9.1 94.89,57.71 96.52,59.33 96.52,60.76 JP10.1
GND  (via drill 0.3)
  Top 0.381: SV1.1 57.3,3.86 56.08,5.08 56.08,7.52 55.47,8.13 v55.47,14.63 55.47,20.93 58.73,24.18 IC7.13 | 51.21,14.22 IC7.8 | 25.2,14.22 IC5.8 | 38.2,14.22 IC6.8 | 64.21,14.22 IC8.8 | 77.22,14.22 IC9.8 | IC10.8 90.22,14.22 96.11,20.12 96.11,22.55 97.74,24.18 IC10.13 | C2.1 50.19,56.9 50.19,59.74 49.17,60.76 C1.1 | LED2.K 17.88,53.44 17.88,45.72 LED1.K 17.68,45.72 14.83,42.88 14.83,30.28 14.94,30.18 | U8.7 76.2,42.88 74.57,42.88 72.54,40.84 68.68,40.84 68.68,41.86 C8.C 68.68,42.06 68.68,43.89 | 68.68,43.89 68.68,45.72 C5.C | 68.68,43.89 63.8,43.89 61.98,42.06 U$7.GND | 37.39,40.03 36.98,40.03 36.98,41.86 C3.C 36.78,42.06 v34.95,42.06 | 37.39,40.03 45.52,40.03 46.13,40.64 46.13,42.88 44.7,42.88 U7.7 | 37.39,40.03 37.39,45.31 36.98,45.72 C6.C | C10.- 14.94,30.18 | 14.94,30.18 14.83,30.07 14.83,23.77 16.66,21.95 C11.- 16.87,21.74 19.1,19.51 19.1,15.24 v20.32,14.02 | JP10.5 96.72,71.12 96.72,73.36 JP10.6 96.72,73.56 73.15,73.56 | JP2.8 75.59,58.93 75.59,61.37 IC4.22 75.59,61.57 v75.59,66.04 | IC4.8 73.15,69.09 73.15,71.53 JP1.8 73.15,71.73 73.15,73.56 | 6.2,31.19 3.25,28.25 3.25,24.79 2.34,23.88 | 6.2,31.19 6.91,31.9 X1.GND | 2.34,23.88 1.42,22.96 U$10.P$1 | U$5.P$1 1.63,9.14 2.44,9.96 2.44,23.77 2.34,23.88 | JP4.2 23.77,73.36 26.21,73.36 JP4.1 | 2.95,54.97 2.85,54.86 2.85,45.72 J3.GND | 2.95,54.97 3.86,55.88 U5.SLEEVE | U6.SLEEVE 3.86,68.89 2.85,67.87 2.85,55.07 2.95,54.97 | 6.2,31.19 3.45,33.93 3.45,38.61 6.71,41.86 J3.GNDBREAK | 73.15,73.56 56.9,73.56 54.86,75.59 36.17,75.59 36.17,74.57 U$1.P$1
  Bottom 0.381: IC5.13 32.92,24.18 33.73,23.37 36.78,23.37 36.98,23.16 40.23,23.16 41.25,24.18 45.72,24.18 IC6.13 45.92,24.18 46.94,23.16 53.24,23.16 54.66,24.59 58.52,24.59 58.73,24.38 IC7.13 58.93,24.18 59.94,23.16 66.04,23.16 67.46,24.59 71.53,24.59 71.73,24.38 IC8.13 71.93,24.18 73.76,24.18 74.78,23.16 78.23,23.16 79.25,24.18 84.73,24.18 IC9.13 | IC10.8 90.02,14.22 89.61,14.22 88.59,15.24 83.72,15.24 83.31,14.83 77.83,14.83 77.22,14.22 IC9.8 77.01,14.22 73.97,14.22 72.95,15.24 70.71,15.24 70.31,14.83 64.82,14.83 64.21,14.22 IC8.8 64.41,14.63 60.55,14.63 59.94,15.24 57.71,15.24 57.3,14.83 55.47,14.83 | 55.47,14.83 51.82,14.83 51.21,14.22 IC7.8 51,14.22 50.39,14.83 47.35,14.83 46.94,15.24 40.23,15.24 39.22,14.22 38.2,14.22 IC6.8 38,14.02 36.98,13.01 31.7,13.01 30.68,14.02 25.2,14.02 IC5.8 24.99,14.02 v20.32,14.02 | 55.47,14.83 v55.47,14.63 | C2.1 46.94,53.65 17.88,53.65 LED2.K | U$7.GND 61.77,41.86 61.16,41.25 53.85,41.25 53.65,41.05 48.56,41.05 47.55,42.06 v34.95,42.06 30.07,42.06 U$6.GND 29.87,41.86 28.04,40.03 24.79,40.03 C10.- 16.66,32.11 6.91,41.86 J3.GNDBREAK 6.71,42.06 3.25,45.52 2.85,45.52 J3.GND | J1.6 54.25,68.28 54.86,67.67 71.73,67.67 72.95,68.89 IC4.8 72.95,68.68 v75.59,66.04 | U$1.P$1 35.97,74.37 34.95,73.36 30.07,73.36 29.87,73.56 26.42,73.56 26.21,73.36 JP4.1 | JP4.2 23.57,73.36 23.57,75.59 8.33,75.59 4.06,71.32 4.06,69.09 U6.SLEEVE
L_IN
  Top 0.381: C4.A 33.33,49.58 30.07,49.58 U$6.AIN | U5.TIP 8.94,51 7.52,52.43 7.52,62.38 8.94,63.8 U6.TIP
  Bottom 0.381: U$6.AIN 29.87,49.58 29.06,50.39 9.55,50.39 9.14,50.8 U5.TIP
N$7
  Top 0.381: LED1.A 14.43,46.53 14.43,52.22 13.82,52.83 13.82,66.45 16.46,69.09 R7.P$1
N$8
  Bottom 0.381: R8.P$1 16.66,55.07 15.24,53.65 LED2.A
N$10  (via drill 0.3)
  Top 0.381: 71.73,42.27 71.73,42.67 U8.2 | v70.1,42.27 71.73,42.27 | v66.85,42.27 65.43,42.27 65.43,42.06 C8.A | 71.73,42.27 U8.3
  Bottom 0.381: v66.85,42.27 v70.1,42.27
N$11  (via drill 0.3)
  Top 0.381: v40.44,21.34 40.64,21.13 v40.64,12.39 | v32.72,12.19 32.72,14.02 IC5.9
  Bottom 0.381: v40.44,21.34 40.84,21.34 41.86,22.35 SJ3.1 | v40.64,12.39 40.44,12.19 v32.72,12.19
N$12  (via drill 0.3)
  Top 0.381: v53.03,13.82 v53.03,21.95
  Bottom 0.381: v53.03,21.95 54.46,21.95 54.86,22.35 SJ4.1 | v53.03,13.82 52.22,13.01 46.94,13.01 45.92,14.02 IC6.9
N$14  (via drill 0.3)
  Top 0.381: U7.3 40.03,42.27 40.03,42.67 U7.2 39.83,42.88 v38.41,42.88 | v34.95,42.88 33.53,42.88 33.53,42.06 C3.A
  Bottom 0.381: v34.95,42.88 v38.41,42.88
N$15  (via drill 0.3)
  Top 0.381: U8.4 71.93,41.45 72.34,41.45 74.57,43.69 74.57,46.94 R6.1 74.78,47.14 74.78,47.55 v76,47.55
  Bottom 0.381: v76,47.55 84.73,47.55 TM2.E
N$16  (via drill 0.3)
  Top 0.381: U7.4 40.03,41.45 42.88,41.45 42.88,46.53 R3.1 42.88,46.74 42.88,47.35 v41.45,47.35
  Bottom 0.381: v41.45,47.35 53.03,47.35 TM1.E
N$17
  Top 0.381: R3.2 40.03,46.74 36.98,49.78 C4.C
N$18
  Top 0.381: R6.2 71.73,47.14 69.29,49.58 68.68,49.58 C7.C
N$19
  Top 0.381: SJ1.2 46.13,49.38 43.08,49.38 43.08,49.58 R4.1
N$20
  Top 0.381: SJ2.2 78.23,49.38 74.78,49.38 74.78,49.99 R5.1
N$23  (via drill 0.3)
  Top 0.381: v66.04,21.34 65.02,20.32 62.38,20.32 v62.38,13.21
  Bottom 0.381: v66.04,21.34 66.85,21.34 67.87,22.35 SJ5.1 | v62.38,13.21 61.57,14.02 58.93,14.02 IC7.9
N$24  (via drill 0.3)
  Top 0.381: v79.65,21.34 79.05,20.73 v79.05,13.82
  Bottom 0.381: v79.65,21.34 79.86,21.34 80.87,22.35 SJ6.1 | v79.05,13.82 78.23,13.01 72.95,13.01 71.93,14.02 IC8.9
N$25
  Bottom 0.381: SJ7.1 94.08,22.55 94.28,22.76 96.72,22.76 96.93,22.96 98.75,22.96 99.57,22.15 99.57,13.01 85.95,13.01 84.94,14.02 IC9.9
R_IN  (via drill 0.3)
  Top 0.381: C7.A 65.23,49.58 61.98,49.58 U$7.AIN 61.77,49.58 v58.73,52.63 | U5.RING 9.14,61.16 10.57,62.59 10.57,72.54 9.14,73.97 U6.RING
  Bottom 0.381: v58.73,52.63 58.52,52.43 40.44,52.43 40.23,52.63 18.9,52.63 17.27,51 13.41,51 10.57,53.85 10.57,60.96 9.14,60.96 U5.RING
RCLK  (via drill 0.3)
  Top 0.381: IC4.4 83.31,69.09 83.31,71.53 JP1.4 | 21.54,68.07 21.54,39.62 21.95,39.22 v21.95,25.2 | 21.54,68.07 21.54,72.75 21.13,73.15 JP4.3 | v56.49,72.95 54.46,74.98 38,74.98 38,68.48 37.19,67.67 26.62,67.67 26.21,68.07 21.54,68.07
  Bottom 0.381: 83.82,20.62 84.73,21.54 IC9.12 | 83.82,20.62 83.72,20.52 72.95,20.52 71.93,21.54 IC8.12 71.73,21.54 70.71,20.52 60.55,20.52 59.54,21.54 58.93,21.54 IC7.12 58.73,21.54 58.32,21.13 52.83,21.13 52.22,20.52 46.94,20.52 45.92,21.54 IC6.12 45.72,21.54 42.67,21.54 41.66,20.52 33.93,20.52 32.92,21.54 IC5.12 32.72,21.74 31.5,22.96 24.18,22.96 v21.95,25.2 | IC10.12 97.74,21.54 96.72,20.52 83.92,20.52 83.82,20.62 | v56.49,72.95 81.89,72.95 83.11,71.73 JP1.4
RES  (via drill 0.3)
  Top 0.381: C9.2 94.69,55.07 92.86,56.9 92.86,67.06 91.03,68.89 IC4.1 90.83,69.09 90.83,71.53 JP1.1 | v36.98,68.48 31.09,74.37 U$1.P$2 | R2.P$1 51.41,65.23 51.41,68.28 J1.5
  Bottom 0.381: v36.98,68.48 51.41,68.48 J1.5 | R2.P$1 49.78,65.23 49.99,65.02 92.25,65.02 92.25,57.51 94.69,55.07 C9.2
ROW1  (via drill 0.3)
  Top 0.381: v60.76,25.6 56.9,25.6 56.9,27.84 55.68,29.06 v55.68,29.46 | v53.03,29.67 52.22,30.48 49.38,30.48 v49.38,29.06 | v24.38,25.6 23.37,24.59 23.37,7.32 22.76,6.71 22.76,5.89 21.74,4.88 21.74,3.86 SV2.1
  Bottom 0.381: v60.76,25.6 65.23,25.6 65.84,26.21 68.68,26.21 71.73,29.26 IC8.15 | v55.68,29.46 55.47,29.67 v53.03,29.67 | v49.38,29.06 48.36,28.04 36.17,28.04 33.73,25.6 v24.38,25.6
ROW2  (via drill 0.3)
  Top 0.381: v59.54,50.19 59.54,36.37 64.01,31.9 IC8.1 | v25.6,51.21 23.16,48.77 23.16,29.06 22.76,28.65 22.76,7.52 SV2.2
  Bottom 0.381: v59.54,50.19 58.52,51.21 40.44,51.21 40.23,51 25.81,51 v25.6,51.21
ROW3
  Bottom 0.381: IC8.2 64.01,29.46 62.99,30.48 28.45,30.48 26.01,28.04 24.18,28.04 22.15,26.01 21.74,26.01 18.49,22.76 18.49,18.09 14.43,18.09 12.39,16.05 12.39,5.08 22.76,5.08 23.98,3.86 SV2.3
ROW4  (via drill 0.3)
  Top 0.381: v56.08,42.06 57.1,41.05 57.1,30.68 60.15,30.68 64.01,26.82 IC8.3 | v36.58,43.69 34.95,45.31 v34.95,56.69 | v13.61,51.82 13.82,51.61 13.82,17.48 12.39,16.05 12.39,11.38 21.13,2.64 22.96,2.64 22.96,5.28 23.98,6.3 SV2.4
  Bottom 0.381: v56.08,42.06 54.46,43.69 49.58,43.69 48.77,42.88 39.42,42.88 38.61,43.69 v36.58,43.69 | v34.95,56.69 16.46,56.69 13.61,53.85 v13.61,51.82
ROW5  (via drill 0.3)
  Top 0.381: v53.03,25.4 49.38,25.4 v49.38,6.71 | v45.92,6.1 44.91,5.08 38,5.08 38,3.25 35.36,0.61 26.82,0.61 26.82,3.66 SV2.5
  Bottom 0.381: v53.03,25.4 59.94,25.4 60.55,24.79 63.6,24.79 64.01,24.38 IC8.4 | v49.38,6.71 48.77,6.1 v45.92,6.1
ROW6  (via drill 0.3)
  Top 0.381: v60.76,21.54 59.54,20.32 56.29,20.32 v56.29,8.33
  Bottom 0.381: v60.76,21.54 64.01,21.54 IC8.5 | v56.29,8.33 56.08,8.53 52.02,8.53 51.82,8.33 40.23,8.33 40.03,8.13 29.06,8.13 27.43,6.5 26.82,6.5 SV2.6
ROW7  (via drill 0.3)
  Top 0.381: v54.66,20.32 54.46,20.12 v54.46,1.42 | v31.5,1.42 29.26,3.66 SV2.7
  Bottom 0.381: v54.66,20.32 59.94,20.32 60.35,19.91 63.4,19.91 64.01,19.3 IC8.6 | v54.46,1.42 54.25,1.63 53.65,1.63 52.63,0.61 32.31,0.61 v31.5,1.42
ROW8  (via drill 0.3)
  Top 0.381: v63.6,11.38 66.04,13.82 66.04,14.63 64.21,16.46 IC8.7 | v29.87,11.38 29.26,10.77 29.26,6.5 SV2.8
  Bottom 0.381: v63.6,11.38 63.4,11.58 48.97,11.58 48.77,11.38 40.84,11.38 40.64,11.58 33.12,11.58 32.92,11.38 v29.87,11.38
ROW9  (via drill 0.3)
  Top 0.381: v66.04,32.31 65.63,32.72 v65.63,38.81 | v11.79,24.38 11.79,10.97 v20.12,2.64
  Bottom 0.381: v66.04,32.31 67.67,30.68 83.52,30.68 84.73,29.46 IC9.15 | v65.63,38.81 65.43,39.01 43.28,39.01 42.88,39.42 26.82,39.42 v11.79,24.38 | v20.12,2.64 30.68,2.64 31.7,3.66 SV2.9
ROW10  (via drill 0.3)
  Top 0.381: v82.7,32.31 83.11,32.72 v83.11,56.08 | v26.62,59.54 22.35,55.27 v22.35,40.23 | v21.13,8.53 v21.13,39.01
  Bottom 0.381: v82.7,32.31 77.62,32.31 77.22,31.9 IC9.1 | v83.11,56.08 82.91,56.29 55.88,56.29 52.63,59.54 v26.62,59.54 | v21.13,39.01 v22.35,40.23 | v21.13,8.53 22.96,6.71 22.96,5.69 23.16,5.69 23.77,5.08 30.48,5.08 SV2.10
ROW11  (via drill 0.3)
  Top 0.381: v81.28,52.43 81.28,43.08 79.05,40.84 79.05,31.29 77.22,29.46 IC9.2 | v48.16,50.39 v51.61,53.85 | v33.12,47.75 31.5,46.13 31.5,32.72 30.48,31.7 30.48,11.79 33.12,9.14 33.12,5.89 34.14,4.88 34.14,3.86 SV2.11
  Bottom 0.381: v81.28,52.43 79.86,53.85 v51.61,53.85 | v48.16,50.39 47.75,49.99 35.36,49.99 v33.12,47.75
ROW12  (via drill 0.3)
  Top 0.381: v79.86,39.22 79.86,29.46 77.22,26.82 IC9.3 | v56.29,40.44 56.49,40.23 v56.49,29.26 | v53.03,26.42 v53.03,28.85 | v43.69,25.4 43.08,24.79 v43.08,14.43 | v39.83,13.21 38,11.38 38,5.89 37.19,5.08 34.75,5.08 34.75,5.89 SV2.12
  Bottom 0.381: v79.86,39.22 78.64,40.44 v56.29,40.44 | v56.49,29.26 55.88,28.65 53.24,28.65 v53.03,28.85 | v53.03,26.42 52.02,25.4 48.16,25.4 47.95,25.2 47.14,25.2 46.94,25.4 v43.69,25.4 | v43.08,14.43 41.86,13.21 v39.83,13.21
ROW13  (via drill 0.3)
  Top 0.381: v66.04,25.4 62.38,25.4 v62.38,26.42 | v47.75,3.05 v47.75,26.01
  Bottom 0.381: v66.04,25.4 76,25.4 77.01,24.38 IC9.4 | v62.38,26.42 60.76,28.04 49.78,28.04 v47.75,26.01 | v47.75,3.05 47.35,2.64 38.81,2.64 37.8,3.66 36.98,3.66 SV2.13
ROW14  (via drill 0.3)
  Top 0.381: v74.37,22.55 74.17,22.76 74.17,32.72 v70.1,36.78 | v40.64,36.78 36.37,32.51 36.37,7.72 36.78,7.32 36.78,6.5 SV2.14
  Bottom 0.381: v74.37,22.55 76.2,22.55 77.01,21.74 IC9.5 | v70.1,36.78 69.9,36.58 67.87,36.58 67.46,36.17 59.94,36.17 59.54,36.58 41.25,36.58 41.05,36.78 v40.64,36.78
ROW15  (via drill 0.3)
  Top 0.381: v74.37,18.9 74.37,12.8 74.17,12.6 v74.17,9.96
  Bottom 0.381: v74.37,18.9 76.81,18.9 77.01,19.1 IC9.6 | v74.17,9.96 73.36,9.14 68.89,9.14 68.68,9.35 63.4,9.35 62.18,8.13 57.1,8.13 56.49,7.52 54.25,7.52 53.85,7.92 52.22,7.92 52.02,7.72 41.66,7.72 40.64,6.71 40.64,3.86 39.42,3.86 SV2.15
ROW16  (via drill 0.3)
  Top 0.381: v73.56,17.27 73.56,12.6 v70.92,9.96 | v39.42,10.16 39.42,6.5 SV2.16
  Bottom 0.381: v73.56,17.27 76.4,17.27 77.01,16.66 IC9.7 | v70.92,9.96 59.74,9.96 59.33,10.36 51.41,10.36 51.21,10.16 v39.42,10.16
ROW17  (via drill 0.3)
  Top 0.381: v88.39,9.35 88.39,22.96 91.44,22.96 97.74,29.26 IC10.15 | v53.85,0.81 52.02,2.64 v52.02,5.28 | v46.33,5.28 45.72,4.67 45.72,3.45 44.91,2.64 42.06,2.64 42.06,3.66 SV2.17
  Bottom 0.381: v88.39,9.35 79.65,0.61 54.05,0.61 v53.85,0.81 | v46.33,5.28 v52.02,5.28
ROW18  (via drill 0.3)
  Top 0.381: v87.38,12.19 87.38,25.4 91.03,25.4 92.05,26.42 92.05,29.87 90.22,31.7 IC10.1 | v65.63,10.77 63.6,8.74 63.6,3.05 62.59,2.03 56.08,2.03 v56.08,3.66
  Bottom 0.381: v87.38,12.19 86.56,11.38 67.06,11.38 66.85,11.58 66.45,11.58 v65.63,10.77 | v56.08,3.66 55.27,4.47 48.97,4.47 48.77,4.67 46.74,4.67 46.53,4.47 45.52,4.47 44.91,5.08 43.28,5.08 42.06,6.3 SV2.18
ROW19  (via drill 0.3)
  Top 0.381: v87.38,52.43 87.38,32.11 90.02,29.46 IC10.2 | v50.6,54.66 47.35,51.41 47.35,45.92 46.74,45.31 46.74,37.39 43.28,33.93 v43.28,26.62 | v41.66,24.99 41.25,24.59 41.25,12.8 46.33,7.72 v46.33,6.91 | v48.56,3.86 v48.56,6.91
  Bottom 0.381: v87.38,52.43 85.14,54.66 v50.6,54.66 | v41.66,24.99 v43.28,26.62 | v48.56,6.91 v46.33,6.91 | v48.56,3.86 44.5,3.86 SV2.19
ROW20  (via drill 0.3)
  Top 0.381: v92.05,32.31 91.24,33.12 v91.24,52.43 | v56.08,57.51 53.85,55.27 51,55.27 51,60.55 49.58,61.98 36.78,61.98 36.58,62.18 27.43,62.18 27.43,22.76 29.67,20.52 v29.67,13.21 | v31.29,12.19 35.76,7.72 v35.76,7.32 | v40.44,7.52 44.3,7.52 44.3,6.5 SV2.20
  Bottom 0.381: v92.05,32.31 92.05,28.65 90.22,26.82 IC10.3 | v91.24,52.43 86.77,56.9 56.69,56.9 v56.08,57.51 | v29.67,13.21 30.68,12.19 v31.29,12.19 | v35.76,7.32 35.97,7.52 v40.44,7.52
RX
  Top 0.381: IC4.2 88.39,69.09 88.39,71.53 JP1.2
  Bottom 0.381: JP10.3 96.52,66.04 94.89,67.67 89.61,67.67 88.39,68.89 IC4.2
SP1  (via drill 0.3)
  Top 0.381: v45.11,48.16 45.11,44.09 44.7,43.69 U7.8 | U$6.SP1 57.91,44.5 56.49,45.92 56.49,48.16 57.71,49.38 JP6.1
  Bottom 0.381: v45.11,48.16 46.33,49.38 57.71,49.38 JP6.1
SP1_2  (via drill 0.3)
  Top 0.381: v76.81,44.3 76.81,44.09 76.4,43.69 U8.8 | JP7.1 89.81,49.38 88.39,47.95 88.39,45.72 89.61,44.5 U$7.SP1
  Bottom 0.381: v76.81,44.3 77.42,43.69 84.12,43.69 84.73,44.3 89.61,44.3 U$7.SP1
SR1_SER  (via drill 0.3)
  Top 0.381: v29.67,29.67 28.04,31.29 28.04,53.03 v36.37,61.37 | v56.08,62.38 57.3,63.6 57.3,68.48 57.71,68.89 IC4.14 57.91,69.09 57.91,71.53 JP1.14
  Bottom 0.381: v29.67,29.67 29.87,29.67 32.72,26.82 IC5.14 | v36.37,61.37 36.58,61.57 47.95,61.57 48.36,61.98 51.82,61.98 52.43,61.37 55.07,61.37 v56.08,62.38
SR2_SER  (via drill 0.3)
  Top 0.381: v43.89,23.37 44.09,23.57 44.09,24.79 45.72,26.42 45.72,26.62 IC6.14 45.92,26.82 47.75,28.65 47.75,35.15 54.66,42.06 54.66,55.07 57.71,58.12 57.71,58.73 JP2.1 57.91,58.93 57.91,61.37 IC4.15
  Bottom 0.381: v43.89,23.37 42.06,23.37 SJ3.2
SR3_SER  (via drill 0.3)
  Top 0.381: v56.29,23.77 56.08,23.98 v56.08,26.21 54.86,27.43 54.86,41.45 55.27,41.86 55.27,53.65 60.35,58.73 JP2.2 60.35,58.93 60.35,61.37 IC4.16
  Bottom 0.381: v56.29,23.77 55.27,23.77 55.07,23.57 SJ4.2 | v56.08,26.21 56.49,26.62 58.73,26.62 IC7.14
SR4_SER  (via drill 0.3)
  Top 0.381: v69.9,23.77 70.1,23.98 70.1,24.99 71.73,26.62 IC8.14 71.73,26.82 70.1,28.45 v70.1,28.65 | IC4.17 62.99,61.37 62.99,58.93 JP2.3 62.79,58.73 55.88,51.82 55.88,44.5 57.71,42.67 57.71,37.39 60.96,34.14 60.96,30.68 v63.8,30.68
  Bottom 0.381: v69.9,23.77 68.28,23.77 68.07,23.57 SJ5.2 | v70.1,28.65 68.68,30.07 65.63,30.07 65.02,30.68 v63.8,30.68
SR5_SER  (via drill 0.3)
  Top 0.381: JP2.4 65.43,58.93 65.43,61.37 IC4.18 | v82.3,57.71 82.3,38.2 81.89,37.8 81.89,29.67 84.73,26.82 IC9.14
  Bottom 0.381: SJ6.2 81.08,23.37 83.52,23.37 83.72,23.16 85.95,23.16 86.56,23.77 86.56,26.62 84.94,26.62 IC9.14 | v82.3,57.71 82.09,57.51 66.85,57.51 65.63,58.73 JP2.4
SR6_SER  (via drill 0.3)
  Top 0.381: v68.07,65.84 68.07,61.57 IC4.19 68.07,61.37 68.07,58.93 JP2.5 68.07,58.73 68.07,57.91 v74.37,51.61
  Bottom 0.381: SJ7.2 94.08,23.57 97.13,26.62 97.74,26.62 IC10.14 97.94,26.82 99.57,28.45 99.57,51.61 v74.37,51.61 | v68.07,65.84 67.87,65.84 67.67,66.04 54.66,66.04 54.46,65.84 54.05,65.84 53.24,66.65 45.52,66.65 44.09,65.23 R8.P$2
SRCLK  (via drill 0.3)
  Top 0.381: JP1.5 80.67,71.53 80.67,69.09 IC4.5 80.87,68.89 86.97,62.79 92.25,62.79 92.25,35.15 96.93,30.48 99.57,30.48 99.57,20.93 97.94,19.3 IC10.11 | v19.71,22.96 19.71,72.14 18.69,73.15 JP4.4
  Bottom 0.381: 44.81,18.19 45.72,19.1 IC6.11 | 44.81,18.19 44.7,18.09 33.93,18.09 32.92,19.1 IC5.11 32.72,19.3 31.7,20.32 22.35,20.32 v19.71,22.96 | 57.81,18.19 57.71,18.09 44.91,18.09 44.81,18.19 | 57.81,18.19 58.73,19.1 IC7.11 | 70.81,18.19 70.71,18.09 57.91,18.09 57.81,18.19 | 70.81,18.19 71.73,19.1 IC8.11 | 83.82,18.19 83.72,18.09 70.92,18.09 70.81,18.19 | 83.82,18.19 84.73,19.1 IC9.11 | IC10.11 97.74,19.1 96.72,18.09 83.92,18.09 83.82,18.19
STDN  (via drill 0.3)
  Top 0.381: v38.41,45.31 38.41,45.11 39.83,43.69 U7.1 | v45.92,46.53 45.92,48.16 46.13,48.36 SJ1.1
  Bottom 0.381: U$6.STDN 30.07,46.94 36.78,46.94 v38.41,45.31 38.41,45.52 44.91,45.52 v45.92,46.53
STDN2  (via drill 0.3)
  Top 0.381: U8.1 71.73,43.69 69.9,45.52 69.9,46.94 69.7,47.14 61.98,47.14 U$7.STDN | v77.01,48.56 78.23,48.56 SJ2.1
  Bottom 0.381: v77.01,48.56 76.81,48.36 63.2,48.36 61.98,47.14 U$7.STDN
TX
  Top 0.381: IC4.3 85.75,69.09 85.75,71.53 JP1.3
  Bottom 0.381: JP10.2 96.72,63.4 93.07,67.06 87.78,67.06 85.95,68.89 IC4.3
VCC  (via drill 0.3)
  Top 0.381: R2.P$2 46.33,55.07 43.89,57.51 33.33,57.51 33.33,54.86 28.65,50.19 28.65,45.72 29.87,44.5 U$6.5V | X1.VBUS 7.11,35.15 9.96,38 9.96,45.72 J3.PWR | JP4.6 13.61,73.36 16.05,73.36 JP4.5 16.05,72.95 18.09,70.92 18.09,60.55 16.66,59.13 R7.P$2 16.66,58.93 19.1,56.49 19.1,39.42 C10.+ 16.66,36.78 18.29,35.15 18.29,28.45 C11.+ | IC7.10 58.73,16.46 57.1,14.83 57.1,6.71 57.3,6.5 SV1.2 | IC4.20 70.71,61.57 72.95,61.57 IC4.21 73.15,61.57 74.78,63.2 74.78,68.07 75.59,68.89 IC4.7 75.59,69.09 75.59,71.53 JP1.7 75.79,71.73 75.79,72.95 92.25,72.95 96.72,68.48 JP10.4 96.93,68.28 98.35,66.85 98.35,32.31 97.94,31.9 IC10.16 97.74,31.9 | 58.73,31.9 IC7.16 | 45.72,31.9 IC6.16 | 32.21,44.6 32.11,44.5 32.11,32.51 32.72,31.9 IC5.16 32.72,31.7 31.09,30.07 31.09,18.29 32.72,16.66 IC5.10 | 32.21,44.6 33.33,45.72 C6.A | C5.A 65.23,45.72 62.59,45.72 62.59,45.11 61.98,44.5 U$7.5V | 71.73,31.9 IC8.16 | 84.73,31.9 IC9.16 | v32.31,44.5 32.21,44.6
  Bottom 0.381: R1.P$2 8.53,12.6 1.42,12.6 1.42,17.68 U$10.P$3 1.42,17.88 7.11,23.57 13.41,23.57 C11.+ | 14.94,40.95 16.46,39.42 16.46,36.98 C10.+ | 14.94,40.95 10.16,45.72 J3.PWR | 14.94,40.95 15.04,41.05 26.62,41.05 29.87,44.3 U$6.5V 30.07,44.5 v32.31,44.5 | IC10.10 97.74,16.46 96.72,15.44 89.2,15.44 88.8,15.85 85.55,15.85 84.94,16.46 IC9.10 84.73,16.46 84.12,15.85 78.64,15.85 78.23,15.44 73.56,15.44 72.54,16.46 71.93,16.46 IC8.10 71.73,16.46 71.12,15.85 65.63,15.85 65.23,15.44 60.55,15.44 59.54,16.46 58.93,16.46 IC7.10 58.73,16.46 58.12,16.46 57.1,15.44 50.19,15.44 49.78,15.85 46.53,15.85 45.92,16.46 IC6.10 45.72,16.46 40.64,16.46 39.62,15.44 33.93,15.44 32.92,16.46 IC5.10 | J1.2 54.25,73.56 54.46,73.76 91.44,73.76 96.72,68.48 JP10.4 | 44.6,33.02 44.5,33.12 34.14,33.12 32.92,31.9 IC5.16 | 44.6,33.02 45.72,31.9 IC6.16 | 44.6,33.02 44.7,33.12 57.51,33.12 58.73,31.9 IC7.16 58.93,31.9 60.15,33.12 68.89,33.12 70.1,31.9 71.73,31.9 IC8.16 71.93,31.9 73.15,33.12 82.3,33.12 | 82.3,33.12 83.52,33.12 83.62,33.02 | 83.62,33.02 84.73,31.9 IC9.16 | IC10.16 97.74,31.9 96.52,33.12 83.72,33.12 83.62,33.02 | 82.3,33.12 82.3,38.61 79.86,41.05 65.23,41.05 61.98,44.3 U$7.5V
XTAL1  (via drill 0.3)
  Top 0.381: 70.51,69.29 70.51,71.53 JP1.9 | 70.51,69.29 70.51,69.09 IC4.9 70.51,69.29 | 70.51,69.29 v64.41,63.2
  Bottom 0.381: C1.2 49.17,63.2 52.02,63.2 52.63,62.59 Y1.2 53.44,63.2 v64.41,63.2
XTAL2  (via drill 0.3)
  Top 0.381: JP1.10 68.07,71.53 68.07,69.09 IC4.10 67.87,68.89 v65.84,66.85 | v54.25,66.65 54.25,59.33 52.83,57.91 Y1.1
  Bottom 0.381: Y1.1 52.43,58.12 49.17,58.12 C2.2 | v54.25,66.65 54.46,66.85 v65.84,66.85

### Text on the board
tPlace: miso | D8 | D7 | D6 | D5 | D4 | D3 | D2 | TX | gnd | gnd | VCC | RX | res | sck | res | 5v | Atmega 328p | RX | TX | D9 | D10 | D11 | D12 | D13 | AVCC | AREF | GND | A0 | A1 | A2 | A3 | A4 | A5 | D13 | 5V Only! | gnd | ROWS | gnd | 2 | 4 | 6 | 8 | 10 | 12 | 14